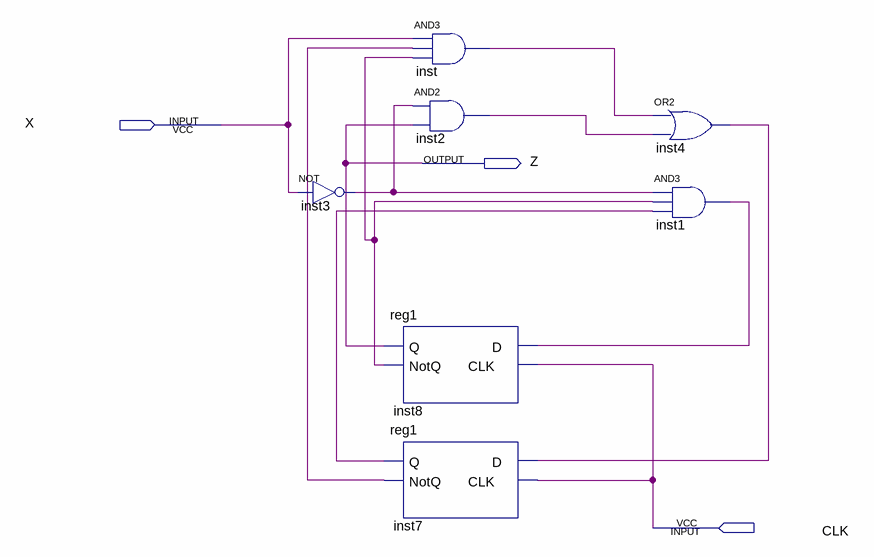
[diagram p0: schematic sheet]
// Quartus schematic HW4C.bdf as structural Verilog: 7 symbols, 3 pins
module HW4C (
  input  X,
  input  CLK,
  output Z
);

  wire inst2_out, inst3_out, inst7_d, inst8_d, inst_out, undriven, undriven_2, undriven_3;

  not inst3 (inst3_out, X);
  and inst (inst_out, X, undriven_2, undriven_3);
  and inst2 (inst2_out, inst3_out, Z);
  reg1 inst8 (.Q(Z), .NotQ(undriven_3), .CLK(CLK), .D(inst8_d));
  reg1 inst7 (.Q(undriven), .NotQ(undriven_2), .CLK(CLK), .D(inst7_d));
  or inst4 (inst7_d, inst_out, inst2_out);
  and inst1 (inst8_d, inst3_out, undriven_3, undriven);
endmodule
